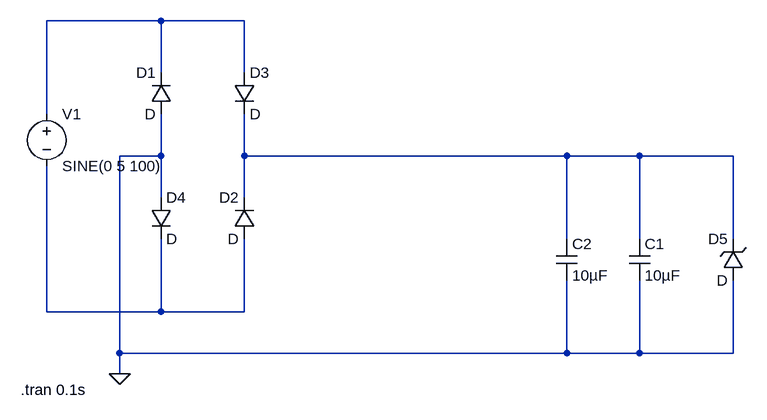
[diagram p0: schematic FullBridgeRectifier.asc]
FullBridgeRectifier.asc, the LTspice schematic file:
Version 4.1
SHEET 1 1128 680
WIRE 224 -48 48 -48
WIRE 352 -48 224 -48
WIRE 224 32 224 -48
WIRE 352 32 352 -48
WIRE 48 96 48 -48
WIRE 224 160 224 96
WIRE 224 160 160 160
WIRE 352 160 352 96
WIRE 848 160 352 160
WIRE 960 160 848 160
WIRE 1104 160 960 160
WIRE 224 224 224 160
WIRE 352 224 352 160
WIRE 848 288 848 160
WIRE 960 288 960 160
WIRE 1104 288 1104 160
WIRE 48 400 48 176
WIRE 224 400 224 288
WIRE 224 400 48 400
WIRE 352 400 352 288
WIRE 352 400 224 400
WIRE 160 464 160 160
WIRE 848 464 848 352
WIRE 848 464 160 464
WIRE 960 464 960 352
WIRE 960 464 848 464
WIRE 1104 464 1104 352
WIRE 1104 464 960 464
WIRE 160 496 160 464
FLAG 160 496 0
SYMBOL voltage 48 80 R0
WINDOW 123 0 0 Left 0
WINDOW 39 0 0 Left 0
SYMATTR InstName V1
SYMATTR Value SINE(0 5 100)
SYMBOL diode 240 96 R180
WINDOW 0 24 64 Left 2
WINDOW 3 24 0 Left 2
SYMATTR InstName D1
SYMBOL diode 368 288 R180
WINDOW 0 24 64 Left 2
WINDOW 3 24 0 Left 2
SYMATTR InstName D2
SYMBOL diode 336 32 R0
SYMATTR InstName D3
SYMBOL diode 208 224 R0
SYMATTR InstName D4
SYMBOL zener 1120 352 R180
WINDOW 0 24 64 Left 2
WINDOW 3 24 0 Left 2
SYMATTR InstName D5
SYMBOL cap 944 288 R0
SYMATTR InstName C1
SYMATTR Value 10µF
SYMBOL cap 832 288 R0
SYMATTR InstName C2
SYMATTR Value 10µF
TEXT 8 520 Left 2 !.tran 0.1s

The netlist it stands for:
* FullBridgeRectifier.asc
V1 N001 N003 SINE(0 5 100)
D1 0 N001 D
D2 N003 N002 D
D3 N001 N002 D
D4 0 N003 D
D5 0 N002 D
C1 N002 0 10µF
C2 N002 0 10µF
.model D D
.lib standard.dio
.tran 0.1s
.backanno
.end